# Altium schematic sheet connections.SchDoc
size A4; PageSetup: Record=PageOptions|CenterHorizontal=False|CenterVertical=False|PrintScale=1.00|XCorrection=1.00|YCorrection=1.00|PrintKind=1|BorderSize=5000000|LeftOffset=0|BottomOffset=0|Orientation=2|PaperLength=1000|PaperWidth=1000|Scale=100|PaperSource=7|PrintQuality=-4|MediaType=1|DitherType=10|PaperKind=A4|PrintScaleMode=0
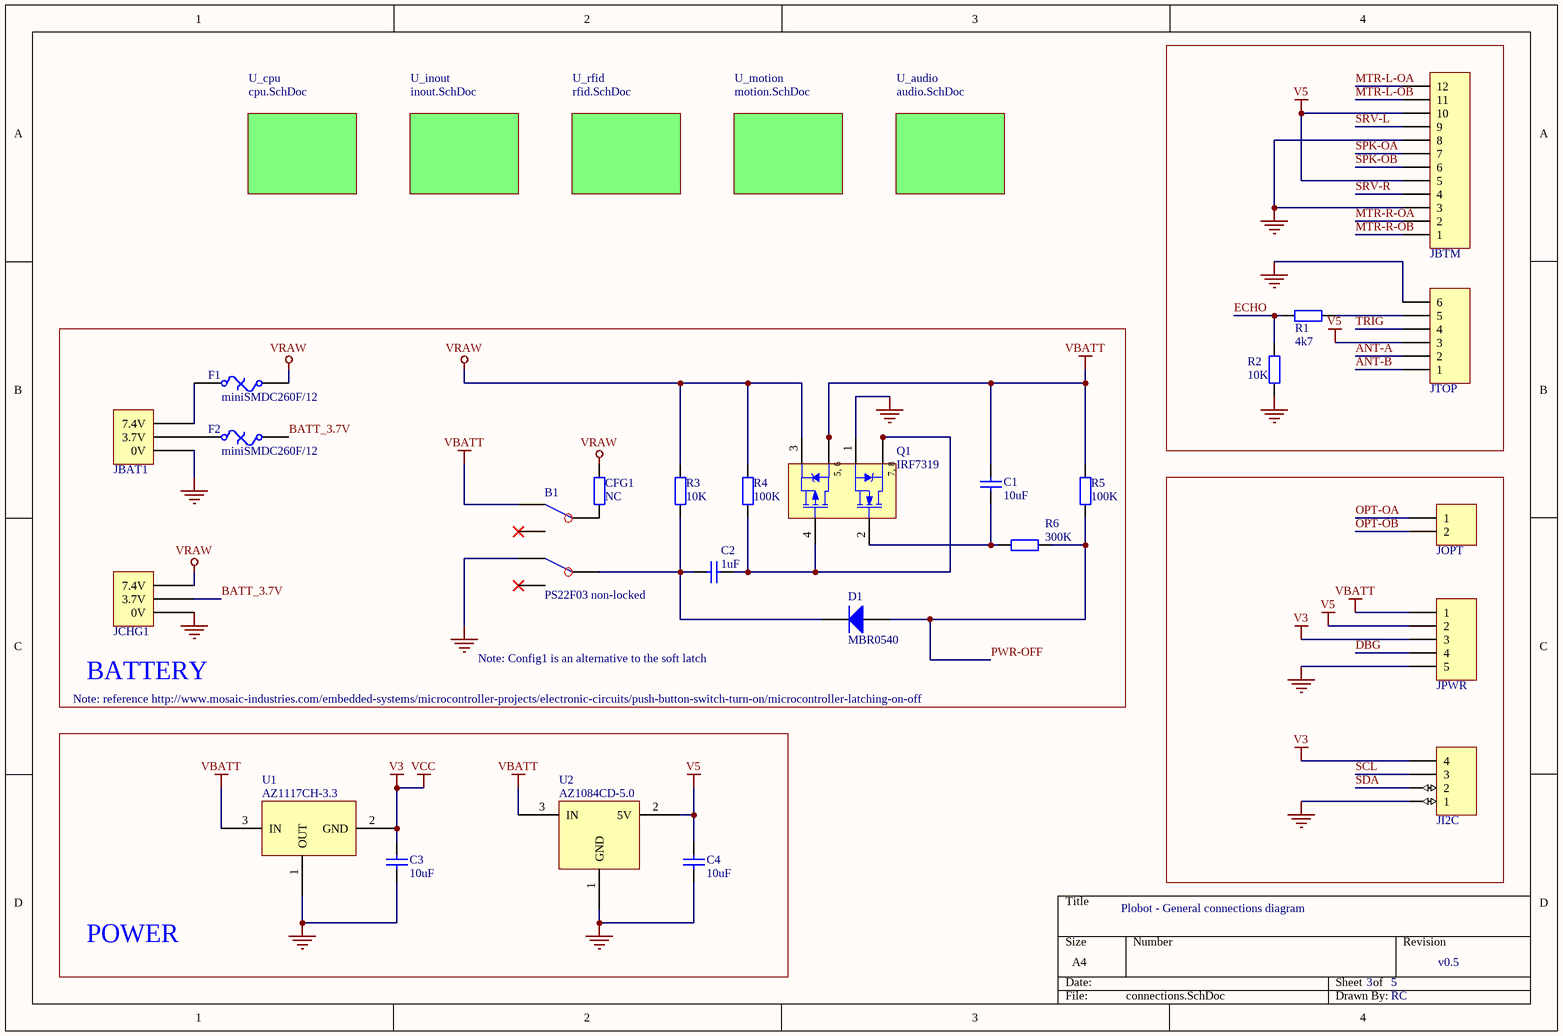
[diagram p0: connections.SchDoc]

## Parts
B1  PS22F03 non-locked  [KGPS22F03]
C1  10uF  [CAPC3216N]
C2  1uF  [CAPC3216N]
C3  10uF  [CAPC3216N]
C4  10uF  [CAPC3216N]
CFG1  NC  [RESC1608N]
D1  MBR0540  [SOD123/X.85]
F1  miniSMDC260F/12  [miniSMDC260F/12]
F2  miniSMDC260F/12  [miniSMDC260F/12]
JBAT1  Charger  [S3B-XH-A(LF)(SN)]  (value not drawn)
JBTM  Header 12  [JST-B12B-XH]  (value not drawn)
JCHG1  Charger  [S3B-XH-A( FEMALE )]  (value not drawn)
JI2C  Header 4  [HDR1X4]  (value not drawn)
JOPT  Header 2  [HDR1X2]  (value not drawn)
JPWR  Component  [HDR1X5]  (value not drawn)
JTOP  w/lock  [JST-B6B-XH]  (value not drawn)
Q1  IRF7319  [SO-8_L]
R1  value 4k7  [RESC1608N]  (hidden comment: 10k)
R2  10K  [RESC1608N]
R3  10K  [RESC1608N]
R4  100K  [RESC1608N]
R5  100K  [RESC1608N]
R6  300K  [RESC1608N]
U1  AZ1117CH-3.3  [SOT223]
U2  AZ1084CD-5.0  [AZ1084CD-5.0]

## Blocks framed on the sheet
BATTERY: B1 C1 C2 CFG1 D1 F1 F2 JBAT1 JCHG1 Q1 R3-R6
POWER: C3 C4 U1 U2

## Sub-sheets
U_audio = audio.SchDoc: no entries
U_cpu = cpu.SchDoc: no entries
U_inout = inout.SchDoc: no entries
U_motion = motion.SchDoc: no entries
U_rfid = rfid.SchDoc: no entries

## Nets
GND: B1.4 C3.2 C4.1 JBAT1.1(0V) JBTM.3 JBTM.8 JCHG1.1(0V) JI2C.1 JPWR.5 JTOP.6 Q1.1(S1) R2.2 U1.1(OUT) U2.1(GND)
V3: C3.1 JI2C.4 JPWR.3 U1.2(GND)  [also labelled VCC]
V5: C4.2 JBTM.5 JBTM.10 JPWR.2 JTOP.3 U2.2(5V)
VBATT: B1.3 C1.1 JPWR.1 Q1.5(D2) Q1.6(D2) R5.2 U1.3(IN) U2.3(IN)
VRAW: CFG1.1 F1.2 JCHG1.3(7.4V) Q1.3(S2) R3.2 R4.2
ANT-A: JTOP.2
ANT-B: JTOP.1
BATT_3.7V: F2.2 JCHG1.2(3.7V)
DBG: JPWR.4
ECHO: R1.1 R2.1
MTR-L-OA: JBTM.12
MTR-L-OB: JBTM.11
MTR-R-OA: JBTM.2
MTR-R-OB: JBTM.1
OPT-OA: JOPT.1
OPT-OB: JOPT.2
PWR-OFF: D1.2(A) R5.1 R6.1
SCL: JI2C.3
SDA: JI2C.2
SPK-OA: JBTM.7
SPK-OB: JBTM.6
SRV-L: JBTM.9
SRV-R: JBTM.4
TRIG: JTOP.4
NetB1_2: B1.2 CFG1.2
NetB1_5: B1.5 C2.1 D1.1(K) R3.1
NetC1_2: C1.2 Q1.2(G1) R6.2
NetC2_2: C2.2 Q1.4(G2) Q1.7(D1) Q1.8(D1) R4.1
NetF1_1: F1.1 JBAT1.3(7.4V)
NetF2_1: F2.1 JBAT1.2(3.7V)
NetJTOP_5: JTOP.5 R1.2

Not connected (* = marked no-connect by the designer): B1 1* 6*

## Notes on the sheet
- Note: reference http://www.mosaic-industries.com/embedded-systems/microcontroller-projects/electronic-circuits/push-button-switch-turn-on/microcontroller-latching-on-off
- Note: Config1 is an alternative to the soft latch
- Plobot - General connections diagram
- 3
- 5
- v0.5
- RC
- (in symbol IRF7319) 5, 6; 7, 8

## Library data of the parts
B1 = Component_1
C1-C4 = Cap_2: Capacitor; PackageReference: RAD-0.3
  C1: Value: 10uF; ComponentLink2Description: Datasheet; ComponentLink3Description: DIGIKEY
  C2: Value: 1uF; ComponentLink2Description: Datasheet; ComponentLink3Description: DIGIKEY
  C3: Published: 8-Jun-2000; LatestRevisionDate: 17-Jul-2002; LatestRevisionNote: Re-released for DXP Platform.; Publisher: Altium Limited; Value: 10uF; PackageDescription: Radial Cap, Thru-Hole; 2 Leads; 0.3 in Pin Spacing
  C4: Published: 8-Jun-2000; LatestRevisionDate: 17-Jul-2002; LatestRevisionNote: Re-released for DXP Platform.; Publisher: Altium Limited; PackageDescription: Radial Cap, Thru-Hole; 2 Leads; 0.3 in Pin Spacing; Value: 10uF
CFG1 R1 R3-R6 = Res2: Resistor; PackageReference: AXIAL-0.4
  CFG1: Value: NC; ComponentLink2Description: Datasheet; ComponentLink3Description: DIGIKEY
  R1: Published: 8-Jun-2000; LatestRevisionDate: 17-Jul-2002; LatestRevisionNote: Re-released for DXP Platform.; Publisher: Altium Limited
  R3: Value: 10K; ComponentLink3Description: DIGIKEY
  R4 R5: Value: 100K; ComponentLink3Description: DIGIKEY
  R6: Value: 300K; ComponentLink3Description: DIGIKEY
D1 = Diode: Default Diode; PackageReference: SMC; ComponentLink3Description: DIGIKEY; ComponentLink3URL: http://www.digikey.com/product-detail/en/fairchild-on-semiconductor/MBR0540/MBR0540TR-ND/1048787
F1 F2 = Fuse Thermal: Thermal Fuse; Published: 24-Mar-1999; LatestRevisionDate: 17-Jul-2002; LatestRevisionNote: Re-released for DXP Platform.; PackageReference: PIN-W2/E2.8; Publisher: Altium Limited
JBAT1 JCHG1 = BATTCON: ComponentLink3Description: TAOBAO; ComponentLink3URL: https://item.taobao.com/item.htm?spm=a1z09.2.0.0.HEqzjA&id=524112080121&_u=goqqgqg0b2c
JBTM = Header 12: Header, 12-Pin; ComponentLink2Description: http://www.digikey.com/product-detail/en/jst-sales-america-inc/B12B-XH-A(LF)(SN)/455-2259-ND/1651057; ComponentLink3Description: DIGIKEY
JI2C = Header 4: Header, 4-Pin; ComponentLink3Description: DIGIKEY
JOPT = Header 2: Header, 2-Pin; LatestRevisionDate: 17-Jul-2002; LatestRevisionNote: Re-released for DXP Platform.; Publisher: Altium Limited
JPWR = Header 5: Header, 5-Pin; LatestRevisionDate: 17-Jul-2002; LatestRevisionNote: Re-released for DXP Platform.; Publisher: Altium Limited
JTOP = Header 6: Header, 6-Pin; ComponentLink2Description: http://www.digikey.com/products/en?keywords=B6B-XH-A(LF)(SN); ComponentLink3Description: DIGIKEY
Q1 = IRF7319: HEXFET Power MOSFET; PackageReference: SO-8; ComponentLink1Description: Manufacturer Link; ComponentLink1URL: http://www.irf.com/; ComponentLink2Description: Datasheet; ComponentLink2URL: http://www.irf.com/product-info/datasheets/data/IRFN140.pdf; ComponentLink3Description: DIGIKEY; ComponentLink3URL: http://www.digikey.com/product-detail/en/infineon-technologies/IRF7319TRPBF/IRF7319PBFTR-ND/812747; Price: 0.4 USD
R2 = Res2: Resistor; Value: 20k; Published: 8-Jun-2000; LatestRevisionDate: 17-Jul-2002; LatestRevisionNote: Re-released for DXP Platform.; PackageReference: AXIAL-0.4; Publisher: Altium Limited
U1 = LM1117